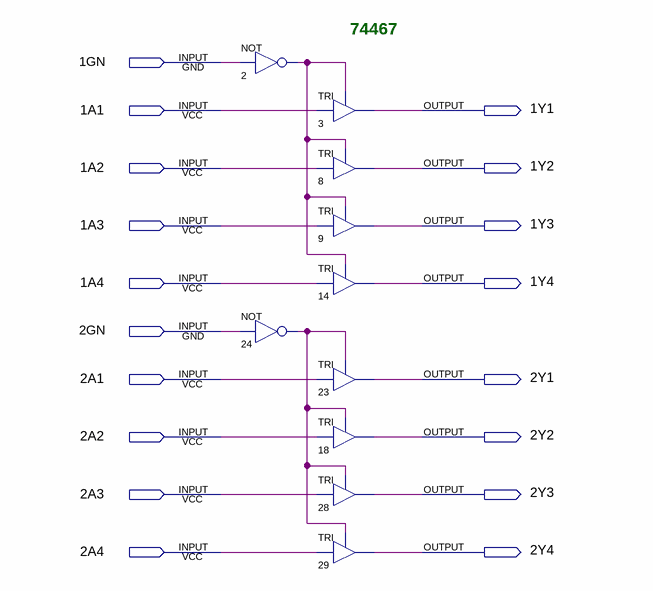
[diagram p0: schematic sheet]
// Quartus schematic 74467.bdf as structural Verilog: 10 symbols, 18 pins
module \74467  (
  input  \1GN ,
  input  \1A1 ,
  input  \1A2 ,
  input  \1A3 ,
  input  \1A4 ,
  input  \2GN ,
  input  \2A1 ,
  input  \2A2 ,
  input  \2A3 ,
  input  \2A4 ,
  output \1Y1 ,
  output \1Y2 ,
  output \1Y3 ,
  output \1Y4 ,
  output \2Y1 ,
  output \2Y2 ,
  output \2Y3 ,
  output \2Y4 
);

  wire n2_out, n24_out;

  not u_2 (n2_out, \1GN );
  not u_24 (n24_out, \2GN );
  TRI u_3 (.IN(\1A1 ), .OE(n2_out), .OUT(\1Y1 ));
  TRI u_8 (.IN(\1A2 ), .OE(n2_out), .OUT(\1Y2 ));
  TRI u_9 (.IN(\1A3 ), .OE(n2_out), .OUT(\1Y3 ));
  TRI u_14 (.IN(\1A4 ), .OE(n2_out), .OUT(\1Y4 ));
  TRI u_23 (.IN(\2A1 ), .OE(n24_out), .OUT(\2Y1 ));
  TRI u_18 (.IN(\2A2 ), .OE(n24_out), .OUT(\2Y2 ));
  TRI u_28 (.IN(\2A3 ), .OE(n24_out), .OUT(\2Y3 ));
  TRI u_29 (.IN(\2A4 ), .OE(n24_out), .OUT(\2Y4 ));

  // Notes on the sheet:
  //   74467
endmodule
